# Altium project RF-UNIT-QRP_20W.PrjPcb
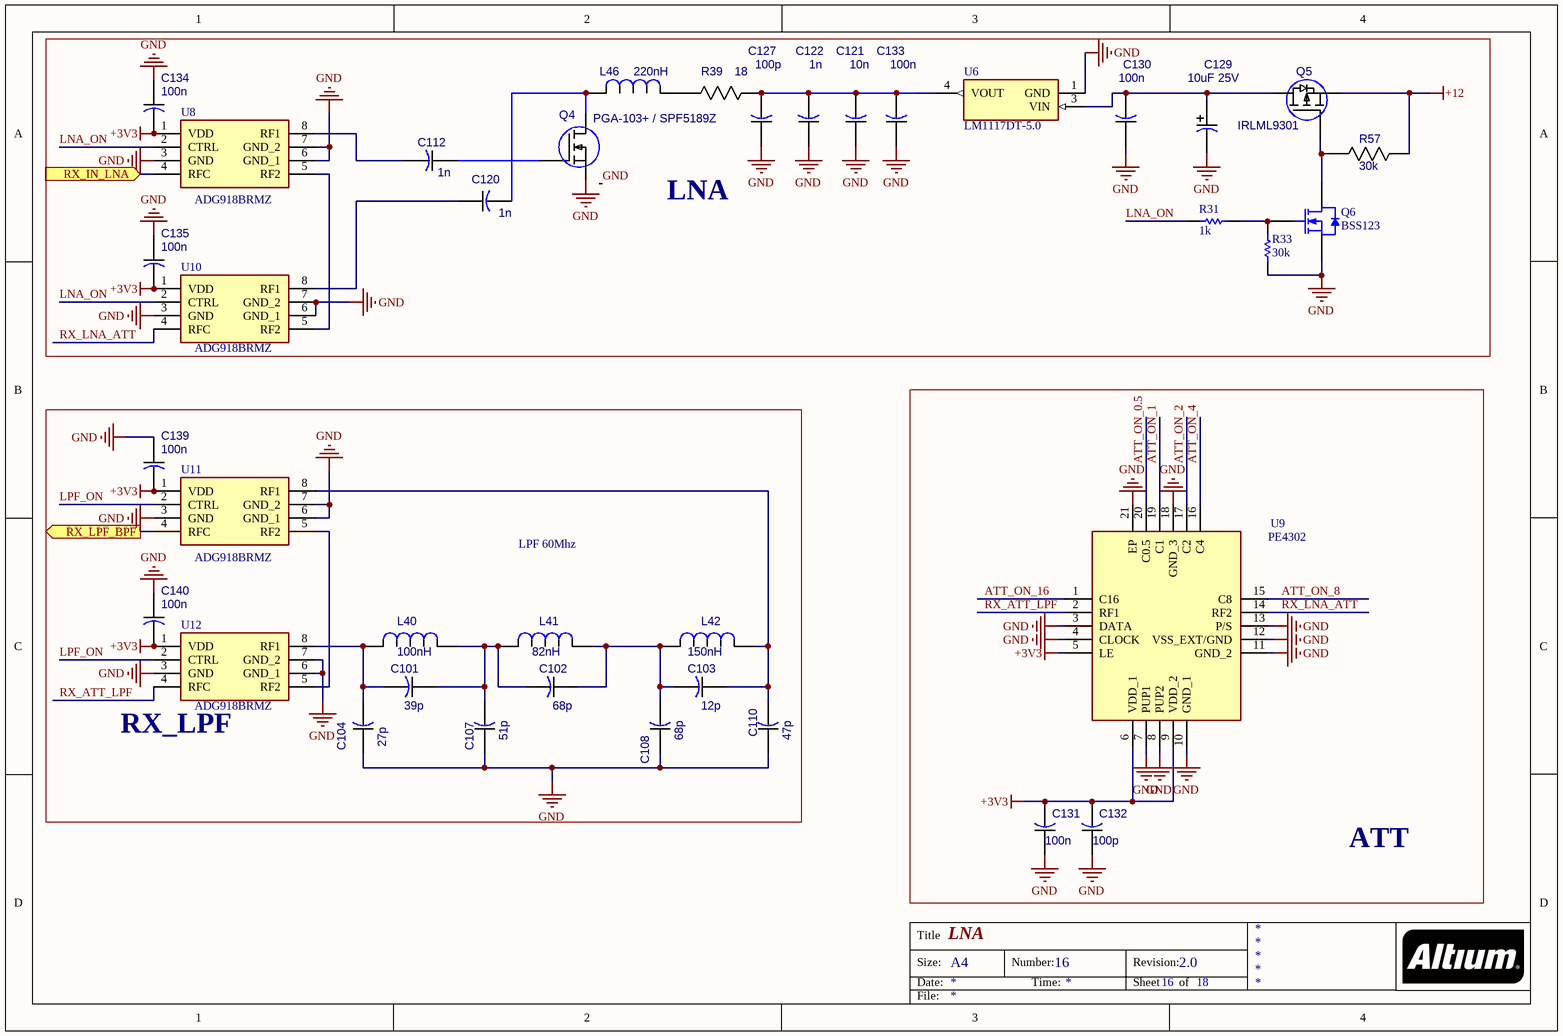
[diagram p0: LNA.SchDoc]
1 sheet, 38 parts. Net scope: global (net labels, ports and power ports of the same name join across sheets).
Board file: RF-UNIT-QRP_20W.PcbDoc

## Sheet LNA.SchDoc: LNA
size A4; DocumentNumber: 16; Revision: 2.0; SheetNumber: 16; SheetTotal: 18

### Parts
C101  39p  [CAP_0805]
C102  68p  [CAP_0805]
C103  12p  [CAP_0805]
C104  27p  [CAP_0805]
C107  51p  [CAP_0805]
C108  68p  [CAP_0805]
C110  47p  [CAP_0805]
C112  1n  [CAP_0805]
C120  1n  [CAP_0805]
C121  10n  [6-0805_M]
C122  1n  [6-0805_M]
C127  100p  [6-0805_M]
C129  10uF 25V  [CAPAE_5.3x5.3h6.1]
C130  100n  [CAP_0805]
C131  100n  [6-0805_M]
C132  100p  [6-0805_M]
C133  100n  [CAP_0805]
C134  100n  [CAP_0805]
C135  100n  [CAP_0805]
C139  100n  [CAP_0805]
C140  100n  [CAP_0805]
L40  100nH  [IND_0805]
L41  82nH  [IND_0805]
L42  150nH  [IND_0805]
L46  220nH  [IND_1206]
Q4  PGA-103+ / SPF5189Z  [SOT89]
Q5  IRLML9301  [SOT23]
Q6  BSS123  [FAIR-SOT23-3_V]
R31  1k  [RESC2013X60X40NL20T25]
R33  30k  [RESC2013X60X40NL20T25]
R39  18  [RES_1206]
R57  30k  [RES_0805]
U6  LM1117DT-5.0  [TO228P991X238-3N]
U8  ADG918BRMZ  [SOP65P490X110-8N]
U9  PE4302  [QFN50P400X400X90-21N]
U10  ADG918BRMZ  [SOP65P490X110-8N]
U11  ADG918BRMZ  [SOP65P490X110-8N]
U12  ADG918BRMZ  [SOP65P490X110-8N]

### Blocks framed on the sheet
LNA: C112 C120-C122 C127 C129 C130 C133-C135 L46 Q4-Q6 R31 R33 R39 R57 U6 U8 U10
RX_LPF: C101-C104 C107 C108 C110 C139 C140 L40-L42 U11 U12
ATT: C131 C132 U9

### Ports
RX_IN_LNA (in), RX_LPF_BPF (out)

### Nets
+3V3: C131.2 C132.2 C134.2 C135.2 C139.2 C140.2 U8.1(VDD) U9.5(LE) U9.6(VDD_1) U9.9(VDD_2) U10.1(VDD) U11.1(VDD) U12.1(VDD)
+12: Q5.2(S) R57.2
GND: C104.1 C107.1 C108.1 C110.1 C121.1 C122.1 C127.1 C129.2(MINUS) C130.1 C131.1 C132.1 C133.1 C134.1 C135.1 C139.1 C140.1 Q4.0 Q4.2(S) Q6.2(S) R33.1 U6.1(GND) U8.3(GND) U8.6(GND_1) U8.7(GND_2) U9.3(DATA) U9.4(CLOCK) U9.7(PUP1) U9.8(PUP2) U9.10(GND_1) U9.11(GND_2) U9.12(VSS_EXT/GND) U9.13(P/S) U9.18(GND_3) U9.21(EP) U10.3(GND) U10.6(GND_1) U10.7(GND_2) U11.3(GND) U11.6(GND_1) U11.7(GND_2) U12.3(GND) U12.6(GND_1) U12.7(GND_2)
ATT_ON_0.5: U9.20(C0.5)
ATT_ON_1: U9.19(C1)
ATT_ON_2: U9.17(C2)
ATT_ON_4: U9.16(C4)
ATT_ON_8: U9.15(C8)
ATT_ON_16: U9.1(C16)
LNA_ON: R31.2 U8.2(CTRL) U10.2(CTRL)
LPF_ON: U11.2(CTRL) U12.2(CTRL)
RX_ATT_LPF: U9.2(RF1) U12.4(RFC)
RX_IN_LNA: U8.4(RFC) ; port RX_IN_LNA
RX_LNA_ATT: U9.14(RF2) U10.4(RFC)
RX_LPF_BPF: U11.4(RFC) ; port RX_LPF_BPF
NetC101_1: C101.1 C102.2 C107.2 L40.2 L41.1
NetC101_2: C101.2 C104.2 L40.1 U12.8(RF1)
NetC102_1: C102.1 C103.2 C108.2 L41.2 L42.1
NetC103_1: C103.1 C110.2 L42.2 U11.8(RF1)
NetC112_1: C112.1 Q4.1(G)
NetC112_2: C112.2 U8.8(RF1)
NetC120_1: C120.1 U10.8(RF1)
NetC120_2: C120.2 L46.2 Q4.3(D)
NetC121_2: C121.2 C122.2 C127.2 C133.2 R39.1 U6.4(VOUT)
NetC129_1: C129.1(PLUS) C130.2 Q5.3(D) U6.3(VIN)
NetL46_1: L46.1 R39.2
NetQ5_1: Q5.1(G) Q6.3(D) R57.1
NetQ6_1: Q6.1(G) R31.1 R33.2
NetU8_5: U8.5(RF2) U10.5(RF2)
NetU11_5: U11.5(RF2) U12.5(RF2)

### Notes on the sheet
- LPF 60Mhz
- Title
- Size:
- Date:
- A4
- Number:
- Time:
- Revision:
- Sheet
- of
- File:

### Library data of the parts
C101-C104 C107 C108 C110 C112 C120-C122 C127 C130-C135 C139 C140 = CAP_0805
  C121: Value: 10n
  C122: Value: 1n
  C127 C132: Value: 100p
  C130 C131 C133-C135 C139 C140: Value: 100n
C129 = CAPAE_5.3x5.3h6.1: Value: 10uF 25V
L40-L42 = IND_0805
L46 = IND_1206: Value: 220nH
Q4 = PGA-103+
Q5 = MOSFET_ENH_PD: MOSFET; Value: IRLML9301
Q6 = CMP-2000-04934-1: N-Channel Logic Level Enhancement Mode Field Effect Transistor, 1.7 V, -55 to 150 degC, 3-Pin SOT-23, RoHS, Tape and Reel; Manufacturer: Fairchild; Channel Type: N; Typical Turn-Off Delay Time: 17ns; Maximum Continuous Drain Current: 0.17A; Rad Hard: No; Typical Rise Time: 9ns; Typical Fall Time: 2.4ns; Maximum Gate Source Voltage: ±20V; Maximum Drain Source Voltage: 100V; Typical Turn-On Delay Time: 1.7ns; RDS-on: 6000@10VmOhm; Package Version: Rev. 12, 03/2016; Packaging: Tape&Reel; Package Reference: SOT23-3; Channel Mode: Enhancement; Operating Temperature: -55to150degC; Package Description: 3-Pin Small Outline Transistor, Body 2.92 x 1.325 mm, Pitch 0.95 mm; Category: MOSFET; Datasheet Version: Jun-03; Datasheet URL: https://www.fairchildsemi.com/datasheets/BS/BSS123.pdf; Manufacturer URL: https://www.fairchildsemi.com/; Mounting: SurfaceMount; Package: 3SOT-23; Package URL: http://www.fairchildsemi.com/dwg/MA/MA03D.pdf
R31 R33 = CMP-2001-00626-1: RES_0805; Manufacturer: Panasonic; Part Number: ERA-6AEB303V
R39 = RES_1206: Value: 18
R57 = RES_0805: Value: 30k
U6 = LM1117DT-ADJ: Integrated Circuit; Manufacturer_Name: Texas Instruments; Datasheet Link: http://www.ti.com/lit/ds/symlink/lm1117-n.pdf; Height: 2.38mm; Manufacturer_Part_Number: LM1117DT-ADJ; Mouser Part Number: 926-LM1117DT-ADJ; Mouser Price/Stock: https://www.mouser.com/Search/Refine.aspx?Keyword=926-LM1117DT-ADJ
U8 U10-U12 = ADG918BRMZ: Integrated Circuit; Manufacturer_Name: Analog Devices; Datasheet Link: http://www.analog.com/static/imported-files/data_sheets/ADG918_919.pdf; Height: 1.1mm; Manufacturer_Part_Number: ADG918BRMZ; Mouser Part Number: 584-ADG918BRMZ; Mouser Price/Stock: https://www.mouser.co.uk/ProductDetail/Analog-Devices/ADG918BRMZ?qs=BpaRKvA4VqHrp1TCwMhfnw%3D%3D; RS Part Number: 4969212P; RS Price/Stock: http://uk.rs-online.com/web/p/products/4969212P
U9 = PE4312C-Z: Integrated Circuit; Manufacturer_Name: pSemi; Datasheet Link: https://www.psemi.com/pdf/datasheets/pe4312ds.pdf; Height: 0.9mm; Manufacturer_Part_Number: PE4312C-Z; Mouser Part Number: N/A; Mouser Price/Stock: https://www.mouser.com/Search/Refine.aspx?Keyword=N%2FA